# Altium schematic sheet V4.SchDoc
size D
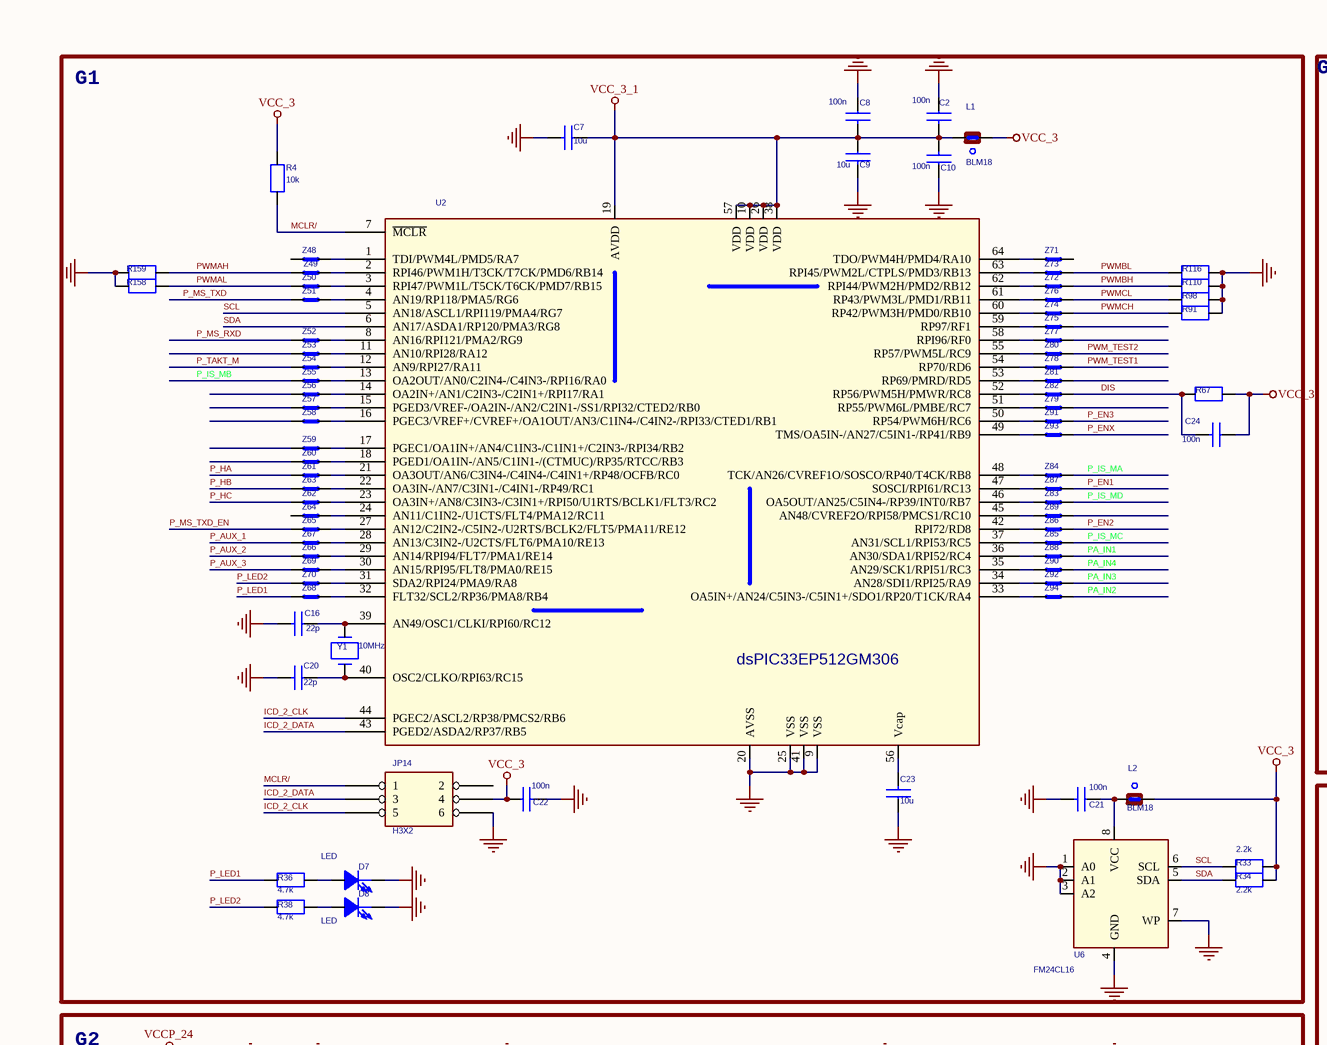
[diagram p0: V4.SchDoc, top left]
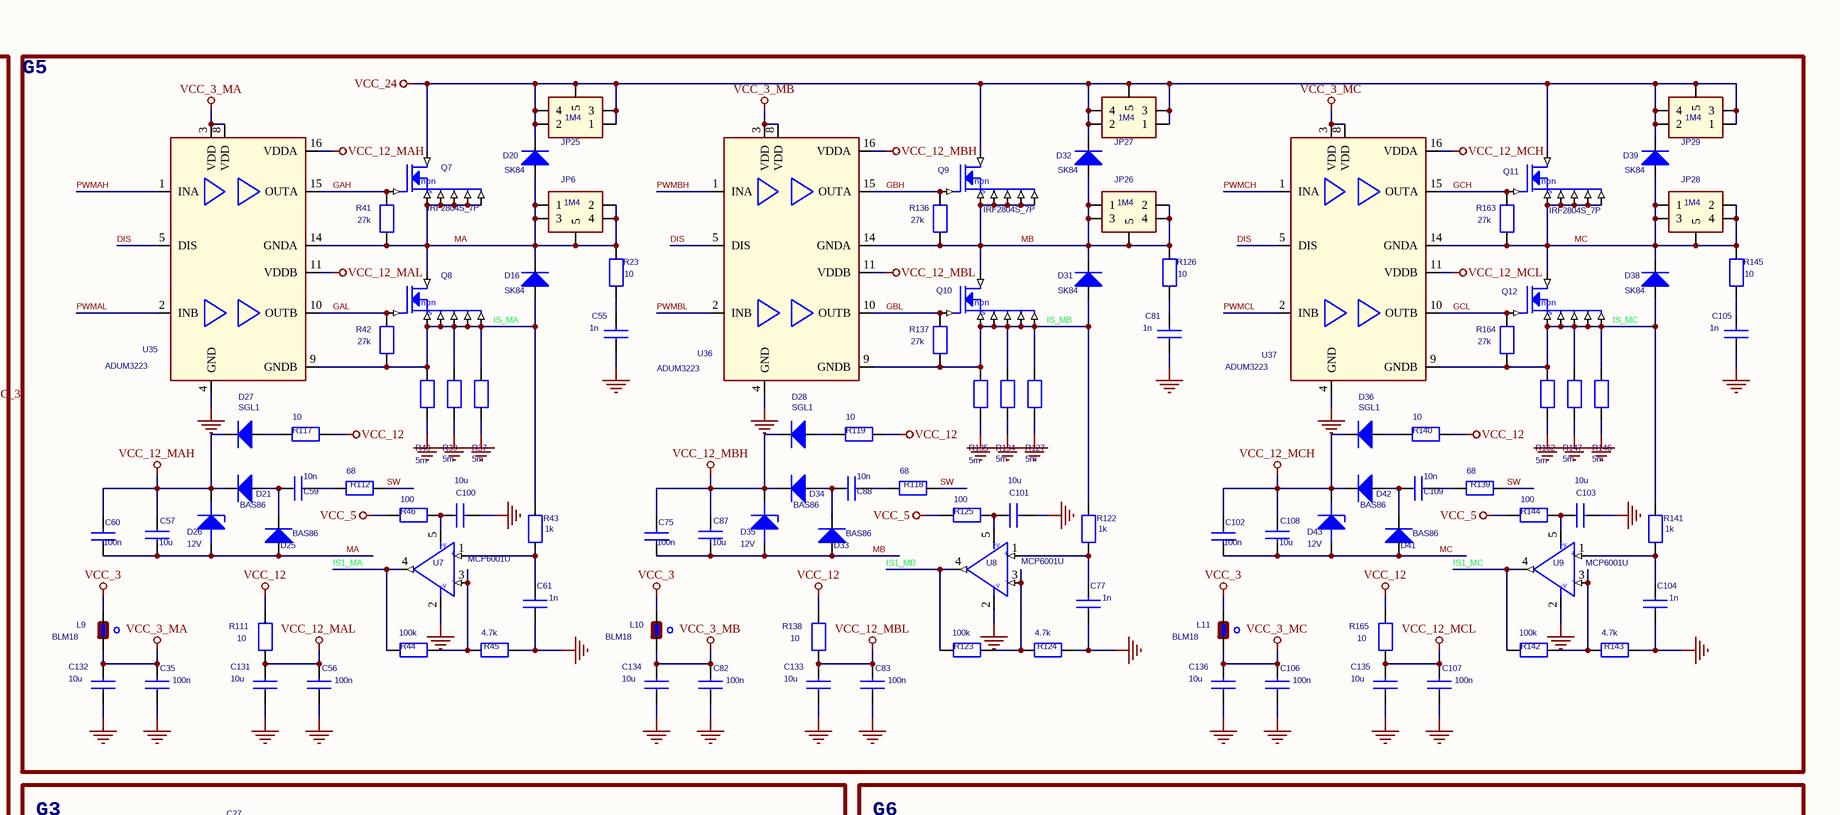
[diagram p1: V4.SchDoc, top right]
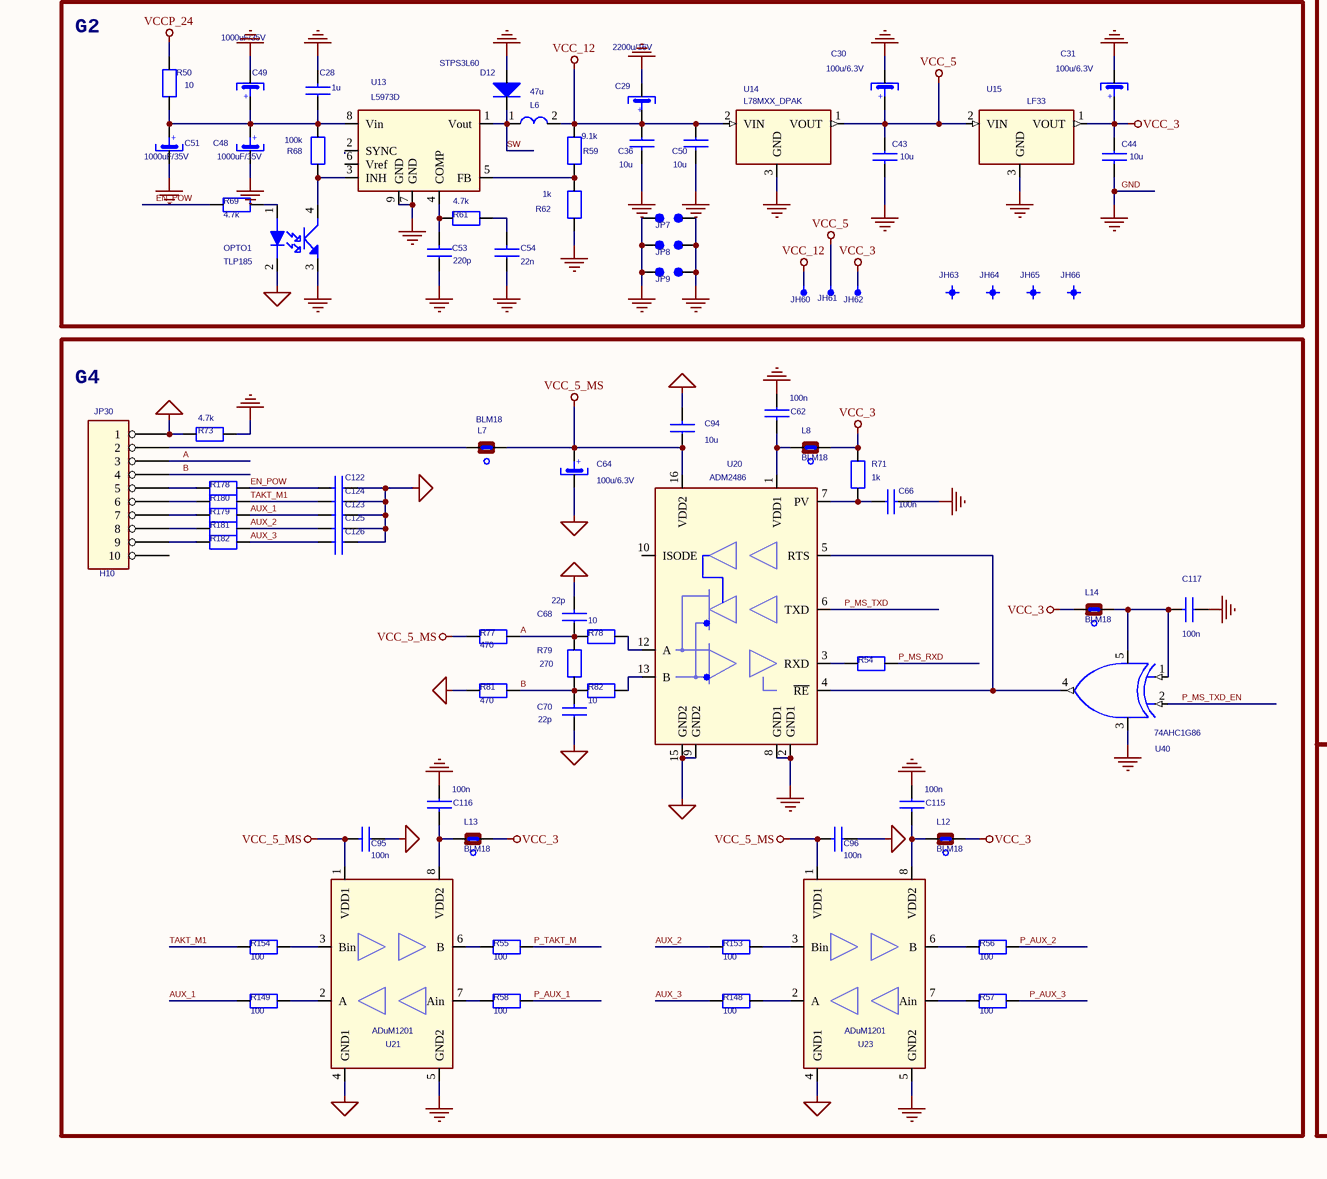
[diagram p2: V4.SchDoc, bottom left]
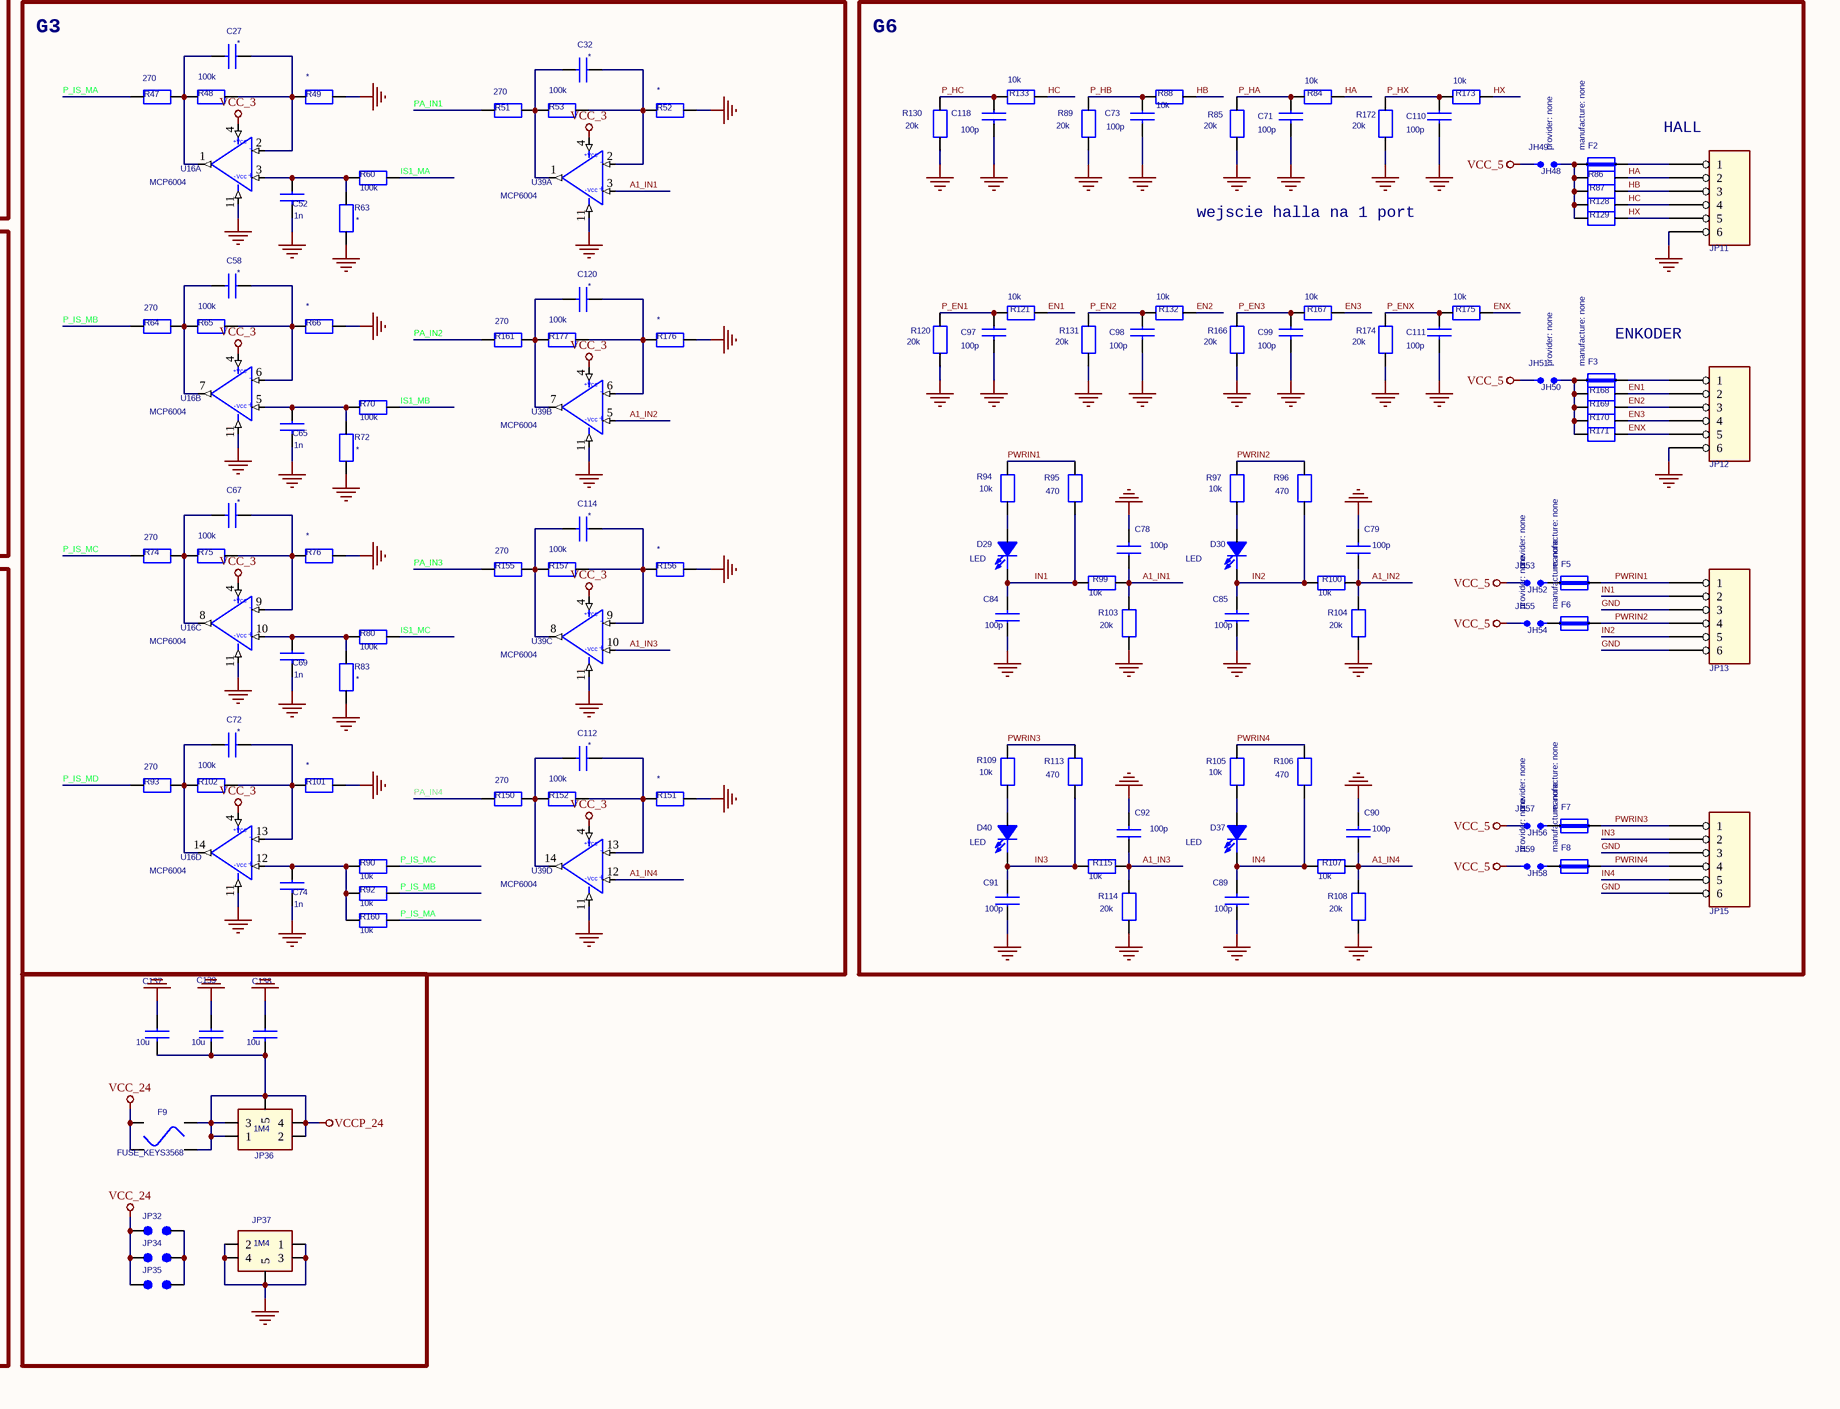
[diagram p3: V4.SchDoc, bottom right]

## Parts
C2  100n  [0805]
C7  10u  [0805]
C8  100n  [0805]
C9  10u  [0805]
C10  100n  [0805]
C16  22p  [0805]
C20  22p  [0805]
C21  100n  [0805]
C22  100n  [0805]
C23  10u  [0805]
C24  100n  [0805]
C27  *  [0805]
C28  1u  [0805]
C29  2200u/16V  [CE_13/RM5MM]
C30  100u/6.3V  [CE_b]
C31  100u/6.3V  [CE_b]
C32  *  [0805]
C35  100n  [0805]
C36  10u  [0805]
C43  10u  [0805]
C44  10u  [0805]
C48  1000uF/35V  [CE_16/RM7.5MM]
C49  1000uF/35V  [CE_16/RM7.5MM]
C50  10u  [0805]
C51  1000uF/35V  [CE_16/RM7.5MM]
C52  1n  [0805]
C53  220p  [0805]
C54  22n  [0805]
C55  1n  [0805]
C56  100n  [0805]
C57  10u  [0805]
C58  *  [0805]
C59  10n  [0805]
C60  100n  [0805]
C61  1n  [0805]
C62  100n  [0805]
C64  100u/6.3V  [CE_b]
C65  1n  [0805]
C66  100n  [0805]
C67  *  [0805]
C68  22p  [0805]
C69  1n  [0805]
C70  22p  [0805]
C71  100p  [0805]
C72  *  [0805]
C73  100p  [0805]
C74  1n  [0805]
C75  100n  [0805]
C77  1n  [0805]
C78  100p  [0805]
C79  100p  [0805]
C81  1n  [0805]
C82  100n  [0805]
C83  100n  [0805]
C84  100p  [0805]
C85  100p  [0805]
C87  10u  [0805]
C88  10n  [0805]
C89  100p  [0805]
C90  100p  [0805]
C91  100p  [0805]
C92  100p  [0805]
C94  10u  [0805]
C95  100n  [0805]
C96  100n  [0805]
C97  100p  [0805]
C98  100p  [0805]
C99  100p  [0805]
C100  10u  [0805]
C101  10u  [0805]
C102  100n  [0805]
C103  10u  [0805]
C104  1n  [0805]
C105  1n  [0805]
C106  100n  [0805]
C107  100n  [0805]
C108  10u  [0805]
C109  10n  [0805]
C110  100p  [0805]
C111  100p  [0805]
C112  *  [0805]
C114  *  [0805]
C115  100n  [0805]
C116  100n  [0805]
C117  100n  [0805]
C118  100p  [0805]
C120  *  [0805]
C122  22p  [0805]  (value not drawn)
C123  22p  [0805]  (value not drawn)
C124  22p  [0805]  (value not drawn)
C125  22p  [0805]  (value not drawn)
C126  22p  [0805]  (value not drawn)
C131  10u  [0805]
C132  10u  [0805]
C133  10u  [0805]
C134  10u  [0805]
C135  10u  [0805]
C136  10u  [0805]
C137  10u  [0805]
C138  10u  [0805]
C139  10u  [0805]
D7  LED  [led5]
D8  LED  [led5]
D12  STPS3L60  [minimelf]
D16  SK84  [minimelf]
D20  SK84  [minimelf]
D21  BAS86  [minimelf]
D25  BAS86  [minimelf]
D26  12V  [D_minimelf]
D27  SGL1  [minimelf]
D28  SGL1  [minimelf]
D29  LED  [led5]
D30  LED  [led5]
D31  SK84  [minimelf]
D32  SK84  [minimelf]
D33  BAS86  [minimelf]
D34  BAS86  [minimelf]
D35  12V  [D_minimelf]
D36  SGL1  [minimelf]
D37  LED  [led5]
D38  SK84  [minimelf]
D39  SK84  [minimelf]
D40  LED  [led5]
D41  BAS86  [minimelf]
D42  BAS86  [minimelf]
D43  12V  [D_minimelf]
F2  FUSE_PTC_1206  [1206]  (value not drawn)
F3  FUSE_PTC_1206  [1206]  (value not drawn)
F5  FUSE_PTC_1206  [1206]  (value not drawn)
F6  FUSE_PTC_1206  [1206]  (value not drawn)
F7  FUSE_PTC_1206  [1206]  (value not drawn)
F8  FUSE_PTC_1206  [1206]  (value not drawn)
F9  FUSE_KEYS3568  [FUSE_KEYS3557-2]
JH48  H1  [SIP1]  (value not drawn)
JH49  H1  [SIP1]  (value not drawn)
JH50  H1  [SIP1]  (value not drawn)
JH51  H1  [SIP1]  (value not drawn)
JH52  H1  [SIP1]  (value not drawn)
JH53  H1  [SIP1]  (value not drawn)
JH54  H1  [SIP1]  (value not drawn)
JH55  H1  [SIP1]  (value not drawn)
JH56  H1  [SIP1]  (value not drawn)
JH57  H1  [SIP1]  (value not drawn)
JH58  H1  [SIP1]  (value not drawn)
JH59  H1  [SIP1]  (value not drawn)
JH60  H1  [SIP1]  (value not drawn)
JH61  H1  [SIP1]  (value not drawn)
JH62  H1  [SIP1]  (value not drawn)
JH63  HOLE_4MM  [SMD_CENT1]  (value not drawn)
JH64  HOLE_4MM  [SMD_CENT1]  (value not drawn)
JH65  HOLE_4MM  [SMD_CENT1]  (value not drawn)
JH66  HOLE_4MM  [SMD_CENT1]  (value not drawn)
JP6  1M4  [1M4]
JP7  JUMPER  [LUT]  (value not drawn)
JP8  JUMPER  [LUT]  (value not drawn)
JP9  JUMPER  [LUT]  (value not drawn)
JP11  H6  [TBMP3808SGNU_6PIN_RM3.81MM]  (value not drawn)
JP12  H6  [TBMP3808SGNU_6PIN_RM3.81MM]  (value not drawn)
JP13  H6  [TBMP3808SGNU_6PIN_RM3.81MM]  (value not drawn)
JP14  H3X2  [sip3-2]
JP15  H6  [TBMP3808SGNU_6PIN_RM3.81MM]  (value not drawn)
JP25  1M4  [1M4]
JP26  1M4  [1M4]
JP27  1M4  [1M4]
JP28  1M4  [1M4]
JP29  1M4  [1M4]
JP30  H10  [TBMP3808SGNU_10PIN_RM3.81MM]
JP32  JUMPER  [LUT]  (value not drawn)
JP34  JUMPER  [LUT]  (value not drawn)
JP35  JUMPER  [LUT]  (value not drawn)
JP36  1M4  [1M4]
JP37  1M4  [1M4]
L1  BLM18  [0603]
L2  BLM18  [0603]
L6  47u  [L10]
L7  BLM18  [0603]
L8  BLM18  [0603]
L9  BLM18  [0603]
L10  BLM18  [0603]
L11  BLM18  [0603]
L12  BLM18  [0603]
L13  BLM18  [0603]
L14  BLM18  [0603]
OPTO1  TLP185  [SMDIP4]
Q7  IRF2804S_7P  [D2PAK_7P]
Q8  IRF2804S_7P  [D2PAK_7P]  (value not drawn)
Q9  IRF2804S_7P  [D2PAK_7P]
Q10  IRF2804S_7P  [D2PAK_7P]  (value not drawn)
Q11  IRF2804S_7P  [D2PAK_7P]
Q12  IRF2804S_7P  [D2PAK_7P]  (value not drawn)
R4  10k  [0805]
R23  10  [0805]
R33  2.2k  [0805]
R34  2.2k  [0805]
R36  4.7k  [0805]
R37  5m  [0805]
R38  4.7k  [0805]
R39  5m  [0805]
R40  5m  [0805]
R41  27k  [0805]
R42  27k  [0805]
R43  1k  [0805]
R44  100k  [0805]
R45  4.7k  [0805]
R46  100  [0805]
R47  270  [0805]
R48  100k  [0805]
R49  *  [0805]
R50  10  [0805]
R51  270  [0805]
R52  *  [0805]
R53  100k  [0805]
R54  100  [0805]  (value not drawn)
R55  100  [0805]
R56  100  [0805]
R57  100  [0805]
R58  100  [0805]
R59  9.1k  [0805]
R60  100k  [0805]
R61  4.7k  [0805]
R62  1k  [0805]
R63  *  [0805]
R64  270  [0805]
R65  100k  [0805]
R66  *  [0805]
R67  10k  [0805]  (value not drawn)
R68  100k  [0805]
R69  4.7k  [0805]
R70  100k  [0805]
R71  1k  [0805]
R72  *  [0805]
R73  4.7k  [0805]
R74  270  [0805]
R75  100k  [0805]
R76  *  [0805]
R77  470  [0805]
R78  10  [0805]
R79  270  [0805]
R80  100k  [0805]
R81  470  [0805]
R82  10  [0805]
R83  *  [0805]
R84  10k  [0805]
R85  20k  [0805]
R86  470  [0805]  (value not drawn)
R87  470  [0805]  (value not drawn)
R88  10k  [0805]
R89  20k  [0805]
R90  10k  [0805]
R91  10k  [0805]  (value not drawn)
R92  10k  [0805]
R93  270  [0805]
R94  10k  [0805]
R95  470  [0805]
R96  470  [0805]
R97  10k  [0805]
R98  10k  [0805]  (value not drawn)
R99  10k  [0805]
R100  10k  [0805]
R101  *  [0805]
R102  100k  [0805]
R103  20k  [0805]
R104  20k  [0805]
R105  10k  [0805]
R106  470  [0805]
R107  10k  [0805]
R108  20k  [0805]
R109  10k  [0805]
R110  10k  [0805]  (value not drawn)
R111  10  [0805]
R112  68  [0805]
R113  470  [0805]
R114  20k  [0805]
R115  10k  [0805]
R116  10k  [0805]  (value not drawn)
R117  10  [0805]
R118  68  [0805]
R119  10  [0805]
R120  20k  [0805]
R121  10k  [0805]
R122  1k  [0805]
R123  100k  [0805]
R124  4.7k  [0805]
R125  100  [0805]
R126  10  [0805]
R127  5m  [0805]
R128  470  [0805]  (value not drawn)
R129  470  [0805]  (value not drawn)
R130  20k  [0805]
R131  20k  [0805]
R132  10k  [0805]
R133  10k  [0805]
R134  5m  [0805]
R135  5m  [0805]
R136  27k  [0805]
R137  27k  [0805]
R138  10  [0805]
R139  68  [0805]
R140  10  [0805]
R141  1k  [0805]
R142  100k  [0805]
R143  4.7k  [0805]
R144  100  [0805]
R145  10  [0805]
R146  5m  [0805]
R147  5m  [0805]
R148  100  [0805]
R149  100  [0805]
R150  270  [0805]
R151  *  [0805]
R152  100k  [0805]
R153  100  [0805]
R154  100  [0805]
R155  270  [0805]
R156  *  [0805]
R157  100k  [0805]
R158  10k  [0805]  (value not drawn)
R159  10k  [0805]  (value not drawn)
R160  10k  [0805]
R161  270  [0805]
R162  5m  [0805]
R163  27k  [0805]
R164  27k  [0805]
R165  10  [0805]
R166  20k  [0805]
R167  10k  [0805]
R168  470  [0805]  (value not drawn)
R169  470  [0805]  (value not drawn)
R170  470  [0805]  (value not drawn)
R171  470  [0805]  (value not drawn)
R172  20k  [0805]
R173  10k  [0805]
R174  20k  [0805]
R175  10k  [0805]
R176  *  [0805]
R177  100k  [0805]
R178  100  [0805]  (value not drawn)
R179  100  [0805]  (value not drawn)
R180  100  [0805]  (value not drawn)
R181  100  [0805]  (value not drawn)
R182  100  [0805]  (value not drawn)
U2  dsPIC33EP512GM306  [TQFP64/0.50MM]
U6  FM24CL16  [SOIC8]
U7  MCP6001U  [SOT23-5]
U8  MCP6001U  [SOT23-5]
U9  MCP6001U  [SOT23-5]
U13  L5973D  [SOIC8_PWR1]
U14  L78MXX_DPAK  [DPAK]
U15  LF33  [DPAK]
U16  MCP6004  [SOIC14]  (parts A,B,C,D of 4)
U20  ADM2486  [SOIC16M]
U21  ADuM1201  [SOIC8]
U23  ADuM1201  [SOIC8]
U35  ADUM3223  [SOIC16]
U36  ADUM3223  [SOIC16]
U37  ADUM3223  [SOIC16]
U39  MCP6004  [SOIC14]  (parts A,B,C,D of 4)
U40  74AHC1G86  [SOT23]
Y1  10MHz  [QS]
Z48  ZWTP  [ZWTP]  (value not drawn)
Z49  ZWTP  [ZWTP]  (value not drawn)
Z50  ZWTP  [ZWTP]  (value not drawn)
Z51  ZWTP  [ZWTP]  (value not drawn)
Z52  ZWTP  [ZWTP]  (value not drawn)
Z53  ZWTP  [ZWTP]  (value not drawn)
Z54  ZWTP  [ZWTP]  (value not drawn)
Z55  ZWTP  [ZWTP]  (value not drawn)
Z56  ZWTP  [ZWTP]  (value not drawn)
Z57  ZWTP  [ZWTP]  (value not drawn)
Z58  ZWTP  [ZWTP]  (value not drawn)
Z59  ZWTP  [ZWTP]  (value not drawn)
Z60  ZWTP  [ZWTP]  (value not drawn)
Z61  ZWTP  [ZWTP]  (value not drawn)
Z62  ZWTP  [ZWTP]  (value not drawn)
Z63  ZWTP  [ZWTP]  (value not drawn)
Z64  ZWTP  [ZWTP]  (value not drawn)
Z65  ZWTP  [ZWTP]  (value not drawn)
Z66  ZWTP  [ZWTP]  (value not drawn)
Z67  ZWTP  [ZWTP]  (value not drawn)
Z68  ZWTP  [ZWTP]  (value not drawn)
Z69  ZWTP  [ZWTP]  (value not drawn)
Z70  ZWTP  [ZWTP]  (value not drawn)
Z71  ZWTP  [ZWTP]  (value not drawn)
Z72  ZWTP  [ZWTP]  (value not drawn)
Z73  ZWTP  [ZWTP]  (value not drawn)
Z74  ZWTP  [ZWTP]  (value not drawn)
Z75  ZWTP  [ZWTP]  (value not drawn)
Z76  ZWTP  [ZWTP]  (value not drawn)
Z77  ZWTP  [ZWTP]  (value not drawn)
Z78  ZWTP  [ZWTP]  (value not drawn)
Z79  ZWTP  [ZWTP]  (value not drawn)
Z80  ZWTP  [ZWTP]  (value not drawn)
Z81  ZWTP  [ZWTP]  (value not drawn)
Z82  ZWTP  [ZWTP]  (value not drawn)
Z83  ZWTP  [ZWTP]  (value not drawn)
Z84  ZWTP  [ZWTP]  (value not drawn)
Z85  ZWTP  [ZWTP]  (value not drawn)
Z86  ZWTP  [ZWTP]  (value not drawn)
Z87  ZWTP  [ZWTP]  (value not drawn)
Z88  ZWTP  [ZWTP]  (value not drawn)
Z89  ZWTP  [ZWTP]  (value not drawn)
Z90  ZWTP  [ZWTP]  (value not drawn)
Z91  ZWTP  [ZWTP]  (value not drawn)
Z92  ZWTP  [ZWTP]  (value not drawn)
Z93  ZWTP  [ZWTP]  (value not drawn)
Z94  ZWTP  [ZWTP]  (value not drawn)

## Blocks framed on the sheet
G1: C2 C7-C10 C16 C20-C24 D7 D8 JP14 L1 L2 R4 R33 R34 R36 R38 R67 R91 R98 R110 R116 R158 R159 U2 U6 Y1 Z48-Z94
G5: C35 C55-C57 C59-C61 C75 C77 C81-C83 C87 C88 C100-C109 C131-C136 D16 D20 D21 D25-D28 D31-D36 D38 D39 D41-D43 JP6 JP25-JP29 L9-L11 Q7-Q12 R23 R37 R39-R46 R111 R112 R117-R119 R122-R127 R134-R147 R162-R165 U7-U9 U35-U37
G3: C27 C32 C52 C58 C65 C67 C69 C72 C74 C112 C114 C120 R47-R49 R51-R53 R60 R63-R66 R70 R72 R74-R76 R80 R83 R90 R92 R93 R101 R102 R150-R152 R155-R157 R160 R161 R176 R177 U16 U39
G6: C71 C73 C78 C79 C84 C85 C89-C92 C97-C99 C110 C111 C118 D29 D30 D37 D40 F2 F3 F5-F8 JH48-JH59 JP11-JP13 JP15 R84-R89 R94-R97 R99 R100 R103-R109 R113-R115 R120 R121 R128-R133 R166-R175
G2: C28-C31 C36 C43 C44 C48-C51 C53 C54 D12 JH60-JH66 JP7-JP9 L6 OPTO1 R50 R59 R61 R62 R68 R69 U13-U15
G4: C62 C64 C66 C68 C70 C94-C96 C115-C117 C122-C126 JP30 L7 L8 L12-L14 R54-R58 R71 R73 R77-R79 R81 R82 R148 R149 R153 R154 R178-R182 U20 U21 U23 U40

## Nets
GND: C2.1 C7.2 C8.1 C9.2 C10.1 C16.2 C20.2 C21.2 C22.2 C23.1 C28.2 C29.2 C30.2 C31.2 C35.1 C36.2 C43.2 C44.2 C48.2 C49.2 C50.2 C51.2 C52.2 C53.1 C54.1 C55.1 C56.1 C61.1 C62.1 C65.2 C66.2 C69.2 C71.2 C73.2 C74.2 C77.1 C78.2 C79.2 C81.1 C82.1 C83.1 C84.1 C85.1 C89.1 C90.2 C91.1 C92.2 C97.2 C98.2 C99.2 C100.2 C101.2 C103.2 C104.1 C105.1 C106.1 C107.1 C110.2 C111.2 C115.1 C116.1 C117.1 C118.2 C131.1 C132.1 C133.1 C134.1 C135.1 C136.1 C137.1 C138.1 C139.1 D7.1 D8.1 D12.2 JP7.1 JP7.2 JP8.1 JP8.2 JP9.1 JP9.2 JP11.6 JP12.6 JP13.3 JP13.6 JP14.6 JP15.3 JP15.6 JP37.1 JP37.2 JP37.3 JP37.4 JP37.5 OPTO1.3 R37.1 R39.1 R40.1 R45.1 R49.1 R52.1 R62.2 R63.1 R66.1 R72.1 R73.1 R76.1 R83.1 R85.2 R89.2 R91.2 R98.2 R101.1 R103.1 R104.1 R108.1 R110.2 R114.1 R116.2 R120.2 R124.1 R127.1 R130.2 R131.2 R134.1 R135.1 R143.1 R146.1 R147.1 R151.1 R156.1 R158.2 R159.2 R162.1 R166.2 R172.2 R174.2 R176.1 U2.9(VSS) U2.20(AVSS) U2.25(VSS) U2.41(VSS) U6.1(A0) U6.2(A1) U6.3(A2) U6.4(GND) U6.7(WP) U7.2(V-) U8.2(V-) U9.2(V-) U13.7(GND) U13.9(GND) U14.3(GND) U15.3(GND) U16.11(V-) U20.2(GND1) U20.8(GND1) U21.5(GND2) U23.5(GND2) U35.4(GND) U36.4(GND) U37.4(GND) U39.11(V-) U40.3(GND)
GND_FIELD SIGNAL: C64.2 C68.2 C70.1 C94.2 C95.1 C96.1 C122.1 C123.1 C124.1 C125.1 C126.1 JP30.1 OPTO1.2(LED_CATHODE) R73.2 R81.2 U20.9(GND2) U20.15(GND2) U21.4(GND1) U23.4(GND1)
VCC_3: C22.1 C24.1 C31.1 C44.1 JH62.1 JP14.4 L1.2 L2.1 L8.2 L9.2 L10.2 L11.2 L12.2 L13.2 L14.1 R4.1 R33.1 R34.1 R67.2 R71.2 U15.1(VOUT) U16.4(V+) U39.4(V+)
VCC_3_1: C2.2 C7.1 C8.2 C9.1 C10.2 L1.1 U2.10(VDD) U2.19(AVDD) U2.26(VDD) U2.38(VDD) U2.57(VDD)
VCC_3_MA: C35.2 C132.2 L9.1 U35.3(VDD) U35.8(VDD)
VCC_3_MB: C82.2 C134.2 L10.1 U36.3(VDD) U36.8(VDD)
VCC_3_MC: C106.2 C136.2 L11.1 U37.3(VDD) U37.8(VDD)
VCC_5: C30.1 C43.1 JH49.1 JH51.1 JH53.1 JH55.1 JH57.1 JH59.1 JH61.1 R46.2 R125.2 R144.2 U14.1(VOUT) U15.2(VIN)
VCC_5_MS: C64.1 C94.1 C95.2 C96.2 L7.2 R77.2 U20.16(VDD2) U21.1(VDD1) U23.1(VDD1)
VCC_12: C29.1 C36.1 C50.1 JH60.1 L6.2 R59.1 R111.2 R117.1 R119.1 R138.2 R140.1 R165.2 U14.2(VIN)
VCC_12_MAH: C57.1 C60.2 D21.1 D26.1 D27.1 U35.16(VDDA)
VCC_12_MAL: C56.2 C131.2 R111.1 U35.11(VDDB)
VCC_12_MBH: C75.2 C87.1 D28.1 D34.1 D35.1 U36.16(VDDA)
VCC_12_MBL: C83.2 C133.2 R138.1 U36.11(VDDB)
VCC_12_MCH: C102.2 C108.1 D36.1 D42.1 D43.1 U37.16(VDDA)
VCC_12_MCL: C107.2 C135.2 R165.1 U37.11(VDDB)
VCC_24: D20.1 D32.1 D39.1 F9.3 F9.4 JP25.1 JP25.2 JP25.3 JP25.4 JP25.5 JP27.1 JP27.2 JP27.3 JP27.4 JP27.5 JP29.1 JP29.2 JP29.3 JP29.4 JP29.5 JP32.2 JP34.2 JP35.2 Q7.8 Q9.8 Q11.8
VCCP_24: C137.2 C138.2 C139.2 F9.1 F9.2 JP36.1 JP36.2 JP36.3 JP36.4 JP36.5 R50.2
A: C68.1 JP30.3 R77.1 R78.2 R79.2
A1_IN1: C78.1 R99.1 R103.2 U39.3(IN+)
A1_IN2: C79.1 R100.1 R104.2 U39.5(IN+)
A1_IN3: C92.1 R114.2 R115.1 U39.10(IN+)
A1_IN4: C90.1 R107.1 R108.2 U39.12(IN+)
AUX_1: C123.2 R149.2 R179.1
AUX_2: C125.2 R153.2 R181.1
AUX_3: C126.2 R148.2 R182.1
B: C70.2 JP30.4 R79.1 R81.1 R82.2
DIS: C24.2 R67.1 U35.5(DIS) U36.5(DIS) U37.5(DIS) Z82.2
EN1: JP12.2 R121.1 R168.1
EN2: JP12.3 R132.1 R169.1
EN3: JP12.4 R167.1 R170.1
EN_POW: C122.2 R69.1 R178.1
ENX: JP12.5 R171.1 R175.1
GAH: Q7.1 R41.2 U35.15(OUTA)
GAL: Q8.1 R42.1 U35.10(OUTB)
GBH: Q9.1 R136.2 U36.15(OUTA)
GBL: Q10.1 R137.1 U36.10(OUTB)
GCH: Q11.1 R163.2 U37.15(OUTA)
GCL: Q12.1 R164.1 U37.10(OUTB)
HA: JP11.2 R84.1 R86.1
HB: JP11.3 R87.1 R88.1
HC: JP11.4 R128.1 R133.1
HX: JP11.5 R129.1 R173.1
ICD_2_CLK: JP14.5 U2.44(PGEC2/ASCL2/RP38/PMCS2/RB6)
ICD_2_DATA: JP14.3 U2.43(PGED2/ASDA2/RP37/RB5)
IN1: C84.2 D29.1 JP13.2 R95.2 R99.2
IN2: C85.2 D30.1 JP13.5 R96.2 R100.2
IN3: C91.2 D40.1 JP15.2 R113.2 R115.2
IN4: C89.2 D37.1 JP15.5 R106.2 R107.2
IS1_MA: R44.2 R60.2 U7.4(OUT)
IS1_MB: R70.2 R123.2 U8.4(OUT)
IS1_MC: R80.2 R142.2 U9.4(OUT)
IS_MA: D16.2 Q8.2 Q8.3 Q8.5 Q8.6 Q8.7 R37.2 R39.2 R40.2 R42.2 R43.1 U35.9(GNDB)
IS_MB: D31.2 Q10.2 Q10.3 Q10.5 Q10.6 Q10.7 R122.1 R127.2 R134.2 R135.2 R137.2 U36.9(GNDB)
IS_MC: D38.2 Q12.2 Q12.3 Q12.5 Q12.6 Q12.7 R141.1 R146.2 R147.2 R162.2 R164.2 U37.9(GNDB)
MA: C57.2 C60.1 D16.1 D20.2 D25.2 D26.2 JP6.1 JP6.2 JP6.3 JP6.4 JP6.5 Q7.2 Q7.3 Q7.5 Q7.6 Q7.7 Q8.8 R23.2 R41.1 U35.14(GNDA)
MB: C75.1 C87.2 D31.1 D32.2 D33.2 D35.2 JP26.1 JP26.2 JP26.3 JP26.4 JP26.5 Q9.2 Q9.3 Q9.5 Q9.6 Q9.7 Q10.8 R126.2 R136.1 U36.14(GNDA)
MC: C102.1 C108.2 D38.1 D39.2 D41.2 D43.2 JP28.1 JP28.2 JP28.3 JP28.4 JP28.5 Q11.2 Q11.3 Q11.5 Q11.6 Q11.7 Q12.8 R145.2 R163.1 U37.14(GNDA)
MCLR/: JP14.1 R4.2 U2.7(~{MCLR})
P_AUX_1: R58.1 Z67.1
P_AUX_2: R56.1 Z66.1
P_AUX_3: R57.1 Z69.1
P_EN1: C97.1 R120.1 R121.2 Z87.2
P_EN2: C98.1 R131.1 R132.2 Z86.2
P_EN3: C99.1 R166.1 R167.2 Z91.2
P_ENX: C111.1 R174.1 R175.2 Z93.2
P_HA: C71.1 R84.2 R85.1 Z61.1
P_HB: C73.1 R88.2 R89.1 Z63.1
P_HC: C118.1 R130.1 R133.2 Z62.1
P_HX: C110.1 R172.1 R173.2
P_IS_MA: R47.2 R160.2 Z84.2
P_IS_MB: R64.2 R92.2 Z55.1
P_IS_MC: R74.2 R90.2 Z85.2
P_IS_MD: R93.2 Z83.2
P_LED1: R36.2 Z68.1
P_LED2: R38.2 Z70.1
P_MS_RXD: R54.1 Z52.1
P_MS_TXD: U20.6(TXD) Z51.1
P_MS_TXD_EN: U40.2(I1) Z65.1
P_TAKT_M: R55.1 Z54.1
PA_IN1: R51.2 Z88.2
PA_IN2: R161.2 Z94.2
PA_IN3: R155.2 Z92.2
PA_IN4: R150.2 Z90.2
PWM_TEST1: Z78.2
PWM_TEST2: Z80.2
PWMAH: R159.1 U35.1(INA) Z49.1
PWMAL: R158.1 U35.2(INB) Z50.1
PWMBH: R110.1 U36.1(INA) Z72.2
PWMBL: R116.1 U36.2(INB) Z73.2
PWMCH: R91.1 U37.1(INA) Z74.2
PWMCL: R98.1 U37.2(INB) Z76.2
PWRIN1: F5.1 JP13.1 R94.1 R95.1
PWRIN2: F6.1 JP13.4 R96.1 R97.1
PWRIN3: F7.1 JP15.1 R109.1 R113.1
PWRIN4: F8.1 JP15.4 R105.1 R106.1
SCL: R33.2 U2.5(AN18/ASCL1/RPI119/PMA4/RG7) U6.6(SCL)
SDA: R34.2 U2.6(AN17/ASDA1/RP120/PMA3/RG8) U6.5(SDA)
SW: D12.1 L6.1 R112.2 R118.2 R139.2 U13.1(Vout)
TAKT_M1: C124.2 R154.2 R180.1
NetC16_1: C16.1 U2.39(AN49/OSC1/CLKI/RPI60/RC12) Y1.2
NetC20_1: C20.1 U2.40(OSC2/CLKO/RPI63/RC15) Y1.1
NetC21_1: C21.1 L2.2 U6.8(VCC)
NetC23_2: C23.2 U2.56(Vcap)
NetC27_1: C27.1 R48.1 R49.2 U16.2(IN-)
NetC27_2: C27.2 R47.1 R48.2 U16.1(OUT)
NetC28_1: C28.1 C48.1 C49.1 C51.1 R50.1 R68.1 U13.8(Vin)
NetC32_1: C32.1 R52.2 R53.1 U39.2(IN-)
NetC32_2: C32.2 R51.1 R53.2 U39.1(OUT)
NetC52_1: C52.1 R60.1 R63.2 U16.3(IN+)
NetC53_2: C53.2 R61.1 U13.4(COMP)
NetC54_2: C54.2 R61.2
NetC55_2: C55.2 R23.1
NetC58_1: C58.1 R65.1 R66.2 U16.6(IN-)
NetC58_2: C58.2 R64.1 R65.2 U16.7(OUT)
NetC59_1: C59.1 D21.2 D25.1
NetC59_2: C59.2 R112.1
NetC61_2: C61.2 R43.2 U7.1(IN+)
NetC62_2: C62.2 L8.1 U20.1(VDD1)
NetC65_1: C65.1 R70.1 R72.2 U16.5(IN+)
NetC66_1: C66.1 R71.1 U20.7(PV)
NetC67_1: C67.1 R75.1 R76.2 U16.9(IN-)
NetC67_2: C67.2 R74.1 R75.2 U16.8(OUT)
NetC69_1: C69.1 R80.1 R83.2 U16.10(IN+)
NetC72_1: C72.1 R101.2 R102.1 U16.13(IN-)
NetC72_2: C72.2 R93.1 R102.2 U16.14(OUT)
NetC74_1: C74.1 R90.1 R92.1 R160.1 U16.12(IN+)
NetC77_2: C77.2 R122.2 U8.1(IN+)
NetC81_2: C81.2 R126.1
NetC88_1: C88.1 D33.1 D34.2
NetC88_2: C88.2 R118.1
NetC100_1: C100.1 R46.1 U7.5(V+)
NetC101_1: C101.1 R125.1 U8.5(V+)
NetC103_1: C103.1 R144.1 U9.5(V+)
NetC104_2: C104.2 R141.2 U9.1(IN+)
NetC105_2: C105.2 R145.1
NetC109_1: C109.1 D41.1 D42.2
NetC109_2: C109.2 R139.1
NetC112_1: C112.1 R151.2 R152.1 U39.13(IN-)
NetC112_2: C112.2 R150.1 R152.2 U39.14(OUT)
NetC114_1: C114.1 R156.2 R157.1 U39.9(IN-)
NetC114_2: C114.2 R155.1 R157.2 U39.8(OUT)
NetC115_2: C115.2 L12.1 U23.8(VDD2)
NetC116_2: C116.2 L13.1 U21.8(VDD2)
NetC117_2: C117.2 L14.2 U40.1(I0) U40.5(VCC)
NetC120_1: C120.1 R176.2 R177.1 U39.6(IN-)
NetC120_2: C120.2 R161.1 R177.2 U39.7(OUT)
NetD7_2: D7.2 R36.1
NetD8_2: D8.2 R38.1
NetD27_2: D27.2 R117.2
NetD28_2: D28.2 R119.2
NetD29_2: D29.2 R94.2
NetD30_2: D30.2 R97.2
NetD36_2: D36.2 R140.2
NetD37_2: D37.2 R105.2
NetD40_2: D40.2 R109.2
NetF2_1: F2.1 JP11.1
NetF2_2: F2.2 JH48.1 R86.2 R87.2 R128.2 R129.2
NetF3_1: F3.1 JP12.1
NetF3_2: F3.2 JH50.1 R168.2 R169.2 R170.2 R171.2
NetF5_2: F5.2 JH52.1
NetF6_2: F6.2 JH54.1
NetF7_2: F7.2 JH56.1
NetF8_2: F8.2 JH58.1
NetJP30_2: JP30.2 L7.1
NetJP30_5: JP30.5 R178.2
NetJP30_6: JP30.6 R180.2
NetJP30_7: JP30.7 R179.2
NetJP30_8: JP30.8 R181.2
NetJP30_9: JP30.9 R182.2
NetJP32_1: JP32.1 JP34.1 JP35.1
NetOPTO1_1: OPTO1.1 R69.2
NetOPTO1_4: OPTO1.4 R68.2 U13.3(INH)
NetR44_1: R44.1 R45.2 U7.3(IN-)
NetR54_2: R54.2 U20.3(RXD)
NetR55_2: R55.2 U21.6(B)
NetR56_2: R56.2 U23.6(B)
NetR57_2: R57.2 U23.7(Ain)
NetR58_2: R58.2 U21.7(Ain)
NetR59_2: R59.2 R62.1 U13.5(FB)
NetR78_1: R78.1 U20.12(A)
NetR82_1: R82.1 U20.13(B)
NetR123_1: R123.1 R124.2 U8.3(IN-)
NetR142_1: R142.1 R143.2 U9.3(IN-)
NetR148_1: R148.1 U23.2(A)
NetR149_1: R149.1 U21.2(A)
NetR153_1: R153.1 U23.3(Bin)
NetR154_1: R154.1 U21.3(Bin)
NetU2_1: U2.1(TDI/PWM4L/PMD5/RA7) Z48.2
NetU2_2: U2.2(RPI46/PWM1H/T3CK/T7CK/PMD6/RB14) Z49.2
NetU2_3: U2.3(RPI47/PWM1L/T5CK/T6CK/PMD7/RB15) Z50.2
NetU2_4: U2.4(AN19/RP118/PMA5/RG6) Z51.2
NetU2_8: U2.8(AN16/RPI121/PMA2/RG9) Z52.2
NetU2_11: U2.11(AN10/RPI28/RA12) Z53.2
NetU2_12: U2.12(AN9/RPI27/RA11) Z54.2
NetU2_13: U2.13(OA2OUT/AN0/C2IN4-/C4IN3-/RPI16/RA0) Z55.2
NetU2_14: U2.14(OA2IN+/AN1/C2IN3-/C2IN1+/RPI17/RA1) Z56.2
NetU2_15: U2.15(PGED3/VREF-/OA2IN-/AN2/C2IN1-/SS1/RPI32/CTED2/RB0) Z57.2
NetU2_16: U2.16(PGEC3/VREF+/CVREF+/OA1OUT/AN3/C1IN4-/C4IN2-/RPI33/CTED1/RB1) Z58.2
NetU2_17: U2.17(PGEC1/OA1IN+/AN4/C1IN3-/C1IN1+/C2IN3-/RPI34/RB2) Z59.2
NetU2_18: U2.18(PGED1/OA1IN-/AN5/C1IN1-/(CTMUC)/RP35/RTCC/RB3) Z60.2
NetU2_21: U2.21(OA3OUT/AN6/C3IN4-/C4IN4-/C4IN1+/RP48/OCFB/RC0) Z61.2
NetU2_22: U2.22(OA3IN-/AN7/C3IN1-/C4IN1-/RP49/RC1) Z63.2
NetU2_23: U2.23(OA3IN+/AN8/C3IN3-/C3IN1+/RPI50/U1RTS/BCLK1/FLT3/RC2) Z62.2
NetU2_24: U2.24(AN11/C1IN2-/U1CTS/FLT4/PMA12/RC11) Z64.2
NetU2_27: U2.27(AN12/C2IN2-/C5IN2-/U2RTS/BCLK2/FLT5/PMA11/RE12) Z65.2
NetU2_28: U2.28(AN13/C3IN2-/U2CTS/FLT6/PMA10/RE13) Z67.2
NetU2_29: U2.29(AN14/RPI94/FLT7/PMA1/RE14) Z66.2
NetU2_30: U2.30(AN15/RPI95/FLT8/PMA0/RE15) Z69.2
NetU2_31: U2.31(SDA2/RPI24/PMA9/RA8) Z70.2
NetU2_32: U2.32(FLT32/SCL2/RP36/PMA8/RB4) Z68.2
NetU2_33: U2.33(OA5IN+/AN24/C5IN3-/C5IN1+/SDO1/RP20/T1CK/RA4) Z94.1
NetU2_34: U2.34(AN28/SDI1/RPI25/RA9) Z92.1
NetU2_35: U2.35(AN29/SCK1/RPI51/RC3) Z90.1
NetU2_36: U2.36(AN30/SDA1/RPI52/RC4) Z88.1
NetU2_37: U2.37(AN31/SCL1/RPI53/RC5) Z85.1
NetU2_42: U2.42(RPI72/RD8) Z86.1
NetU2_45: U2.45(AN48/CVREF2O/RPI58/PMCS1/RC10) Z89.1
NetU2_46: U2.46(OA5OUT/AN25/C5IN4-/RP39/INT0/RB7) Z83.1
NetU2_47: U2.47(SOSCI/RPI61/RC13) Z87.1
NetU2_48: U2.48(TCK/AN26/CVREF1O/SOSCO/RP40/T4CK/RB8) Z84.1
NetU2_49: U2.49(TMS/OA5IN-/AN27/C5IN1-/RP41/RB9) Z93.1
NetU2_50: U2.50(RP54/PWM6H/RC6) Z91.1
NetU2_51: U2.51(RP55/PWM6L/PMBE/RC7) Z79.1
NetU2_52: U2.52(RP56/PWM5H/PMWR/RC8) Z82.1
NetU2_53: U2.53(RP69/PMRD/RD5) Z81.1
NetU2_54: U2.54(RP70/RD6) Z78.1
NetU2_55: U2.55(RP57/PWM5L/RC9) Z80.1
NetU2_58: U2.58(RPI96/RF0) Z77.1
NetU2_59: U2.59(RP97/RF1) Z75.1
NetU2_60: U2.60(RP42/PWM3H/PMD0/RB10) Z74.1
NetU2_61: U2.61(RP43/PWM3L/PMD1/RB11) Z76.1
NetU2_62: U2.62(RPI44/PWM2H/PMD2/RB12) Z72.1
NetU2_63: U2.63(RPI45/PWM2L/CTPLS/PMD3/RB13) Z73.1
NetU2_64: U2.64(TDO/PWM4H/PMD4/RA10) Z71.1
NetU20_4: U20.4(~{RE}) U20.5(RTS) U40.4(O)

Not connected (* = marked no-connect by the designer): JH63 1; JH64 1; JH65 1; JH66 1; JP14 2; JP30 10; U13 2(SYNC) 6(Vref); U20 10(ISODE); Z48 1; Z53 1; Z56 1; Z57 1; Z58 1; Z59 1; Z60 1; Z64 1; Z71 2; Z75 2; Z77 2; Z79 2; Z81 2; Z89 2

## Notes on the sheet
- (near JP11) HALL
- wejscie halla na 1 port
- ENKODER
- (in symbol 324, part A) +Vcc; -; -Vcc; +
- (in symbol 324, part B) +Vcc; -; -Vcc; +
- (in symbol 324, part C) +Vcc; -; -Vcc; +
- (in symbol 324, part D) +Vcc; -; -Vcc; +
- (in symbol CE 2200uF/35V ST) +
- (in symbol EL) +
- (in symbol IRF2804S_7P) npn; s
- (in symbol OP_MCP6001U_SOT23-5) +V; +; -V; -

## Library data of the parts
C2 C10 C22 = C: 100nF 0603 16V  X7R 10%; provider: TME CL10B104KO8NNNC; COMPGROUP: 1
C7 C9 C23 = C: 10uF 0603 6.3V 10% X5R; provider: TME CL10A106KQ8NNNC; COMPGROUP: 1
C8 C21 C24 = C: COMPGROUP: 1
C16 C20 = C: 22p 0603 50V C0G 5%; provider: TME CL10C220JB8NNNC; COMPGROUP: 1
C27 C32 C58 C67 C72 C112 C114 C120 = C: 10nF 0603 50V X7R 10%; provider: TME CL10B103KB8NNNC; COMPGROUP: 3
C28 = C: 1u 1206 50V X7R 10%; provider: TME CL31B105KBHNNNE; COMPGROUP: 2
C29 = EL: 2200u 16V LI 105C; Provider: TME GF2200/16; COMPGROUP: 2
C30 C31 = EL: 100U 6.3V B LI 0.25; Provider: TME TPSB107K006R0250; COMPGROUP: 2
C35 C55-C57 C59 C60 C75 C81-C83 C87 C88 C100-C103 C105-C109 C131-C139 = C: COMPGROUP: 5
C36 C50 = C: COMPGROUP: 2
C43 C44 = C: 10uF 0603 6.3V 10% X5R; provider: TME CL10A106KQ8NNNC; COMPGROUP: 2
C48 C49 C51 = CE 2200uF/35V ST: COMPGROUP: 2
C52 C65 C69 C74 = C: COMPGROUP: 3
C53 = C: 220p 0805 50V C0G 5%; provider: TME CL21C221JBANNNC; COMPGROUP: 2
C54 = C: 22n 0805 50V X7R 10%; provider: TME CL21B223KBANNNC; COMPGROUP: 2
C61 C77 C104 = C: 1n 0603 50V 5% C0G; provider: TME CL10C102JB8NNNC; COMPGROUP: 5
C62 C66 C68 C70 C94-C96 C115-C117 C122-C126 = C: COMPGROUP: 4
C64 = EL: 100U 6.3V B LI 0.25; Provider: TME TPSB107K006R0250; COMPGROUP: 4
C71 C73 C78 C79 C90 C92 C97-C99 C110 C111 C118 = C: 10nF 0603 50V X7R 10%; provider: TME CL10B103KB8NNNC; COMPGROUP: 6
C84 C85 C89 C91 = C: COMPGROUP: 6
D7 D8 = LED: OSR50603C1C; COMPGROUP: 1; Provider: TME  OSR50603C1C
D12 = D: STPS3L60U; provider: TME STPS3L60U; COMPGROUP: 2
D16 D20 D31 D32 D38 D39 = D: COMPGROUP: 5
D21 D25 D33 D34 D41 D42 = D: provider: TME BAS86; COMPGROUP: 5
D26 D35 D43 = DZ: COMPGROUP: 5
D27 D28 D36 = D: provider: TME SGL1; COMPGROUP: 5
D29 D37 = LED: OSR50603C1C; COMPGROUP: 6; Provider: TME  OSR50603C1C
D30 D40 = LED: OSR50603C1C; Provider: TME  OSR50603C1C; COMPGROUP: 6
F2 F3 F5-F8 = FUSE_PTC_1206: none; COMPGROUP: 6; manufacture: none; provider: none
F9 = FUSE_KEYS3568_CAR
JH48-JH59 = H1: COMPGROUP: 6
JH63-JH66 = SRUBA_3MM
JP6 JP26 JP28 = PCB-1M4: COMPGROUP: 5; Provider: TME 1M4
JP7-JP9 = JUMPER: COMPGROUP: 2
JP11-JP13 JP15 = H6: COMPGROUP: 6
JP14 = H3X2: COMPGROUP: 1
JP25 JP27 JP29 = PCB-1M4: Provider: TME 1M4; COMPGROUP: 5
JP30 = H10: COMPGROUP: 4
JP36 = PCB-1M4: Provider: TME 1M4; COMPGROUP: 6
JP37 = PCB-1M4: COMPGROUP: 6; Provider: TME 1M4
L1 = BLM18: COMPGROUP: 1; Provider: TME LCBA-601
L2 = BLM18: Provider: TME LCBA-601; COMPGROUP: 1
L6 = L: 47u 1205 3A; provider: TME DE1205-47; COMPGROUP: 2
L7 = BLM18: Provider: TME LCBA-601; COMPGROUP: 4
L8 L12-L14 = BLM18: COMPGROUP: 4
L9-L11 = BLM18: Provider: TME LCBA-601; COMPGROUP: 5
OPTO1 = OPTO_TLP185_SMDIP4
Q7-Q12 = IRF2804S_7P: COMPGROUP: 5
R4 = R: 10k 0603; provider: TME SMD0603-10K-1%; COMPGROUP: 1
R23 R37 R39-R43 R46 R111 R112 R117-R119 R122 R125-R127 R134-R141 R144-R147 R162-R165 = R: COMPGROUP: 5
R33 R34 = R: 2.2k 0603; COMPGROUP: 1
R36 R38 = R: 4.7k 0805; provider: TME SMD0805-4K7-1%; COMPGROUP: 1
R44 R45 R123 R124 R142 R143 = R: 100k 0805; provider: TME SMD0805-100K-1%; COMPGROUP: 5
R47 R51 R64 R74 R93 R150 R155 R161 = R: 270 0603; COMPGROUP: 3
R48 R49 R52 R53 R60 R65 R66 R70 R75 R76 R80 R101 R102 R151 R152 R156 R157 R176 R177 = R: 100k 0805; provider: TME SMD0805-100K-1%; COMPGROUP: 3
R50 = R: 10   2010; COMPGROUP: 2
R54-R58 R148 R149 R153 R154 R178-R182 = R: COMPGROUP: 4
R59 R68 = R: 9.1k 0805 1%; provider: TME SMD0805-9K1-1%; COMPGROUP: 2
R61 R69 = R: 4.7k 0805; provider: TME SMD0805-4K7-1%; COMPGROUP: 2
R62 = R: 1k 0805 1%; provider: TME SMD0805-1K-1%; COMPGROUP: 2
R63 R72 R83 = R: 68k 0805; provider: TME SMD0805-68K-1%; COMPGROUP: 3
R67 R90-R92 R98 R110 R116 R158-R160 = R: COMPGROUP: 3
R71 = R: 1k 0805 1%; provider: TME SMD0805-1K-1%; COMPGROUP: 4
R73 R77-R79 R81 R82 = R: 4.7k 0805; provider: TME SMD0805-4K7-1%; COMPGROUP: 4
R84-R89 R99 R100 R103 R104 R107 R108 R114 R115 R120 R121 R128-R133 R166-R175 = R: COMPGROUP: 6
R94 R97 R105 R109 = R: 10k 0603; provider: TME SMD0603-10K-1%; COMPGROUP: 6
R95 R96 R106 R113 = R: 470 1206 1% HP06; provider: TME  HP06-470R1%; COMPGROUP: 6
U2 = dsPIC33EP512GM306_QFN64_B: COMPGROUP: 1
U6 = 24LC64: FM24CL16B-GTR; Provider: TME FM24CL16B-GTR; COMPGROUP: 1
U7-U9 = OP_MCP6001U_SOT23-5: COMPGROUP: 5
U13 = L5973D_SOIC8_PWR1: COMPGROUP: 2
U14 = L78MXX_DPAK: COMPGROUP: 2
U15 = LFxx_DPAK: LF33CDT; Provider: TME LF33CDT; COMPGROUP: 2
U16 U39 = 324: MCP6004-I/SL; COMPGROUP: 3; Provider: TMP MCP6004-I/SL
U20 = RS485_ISOL_ADM2486_SOIC16M: COMPGROUP: 4
U21 U23 = ISOL_ADuM1201_SOIC8: COMPGROUP: 4
U35-U37 = ISOL_MOS_DRV_ADUM3223_SOIC16: COMPGROUP: 5
U40 = 74_1G86_SOT23
Y1 = QS: KWARC 10MHz; COMPGROUP: 1; Provider: TME 10.00M-HC49-S